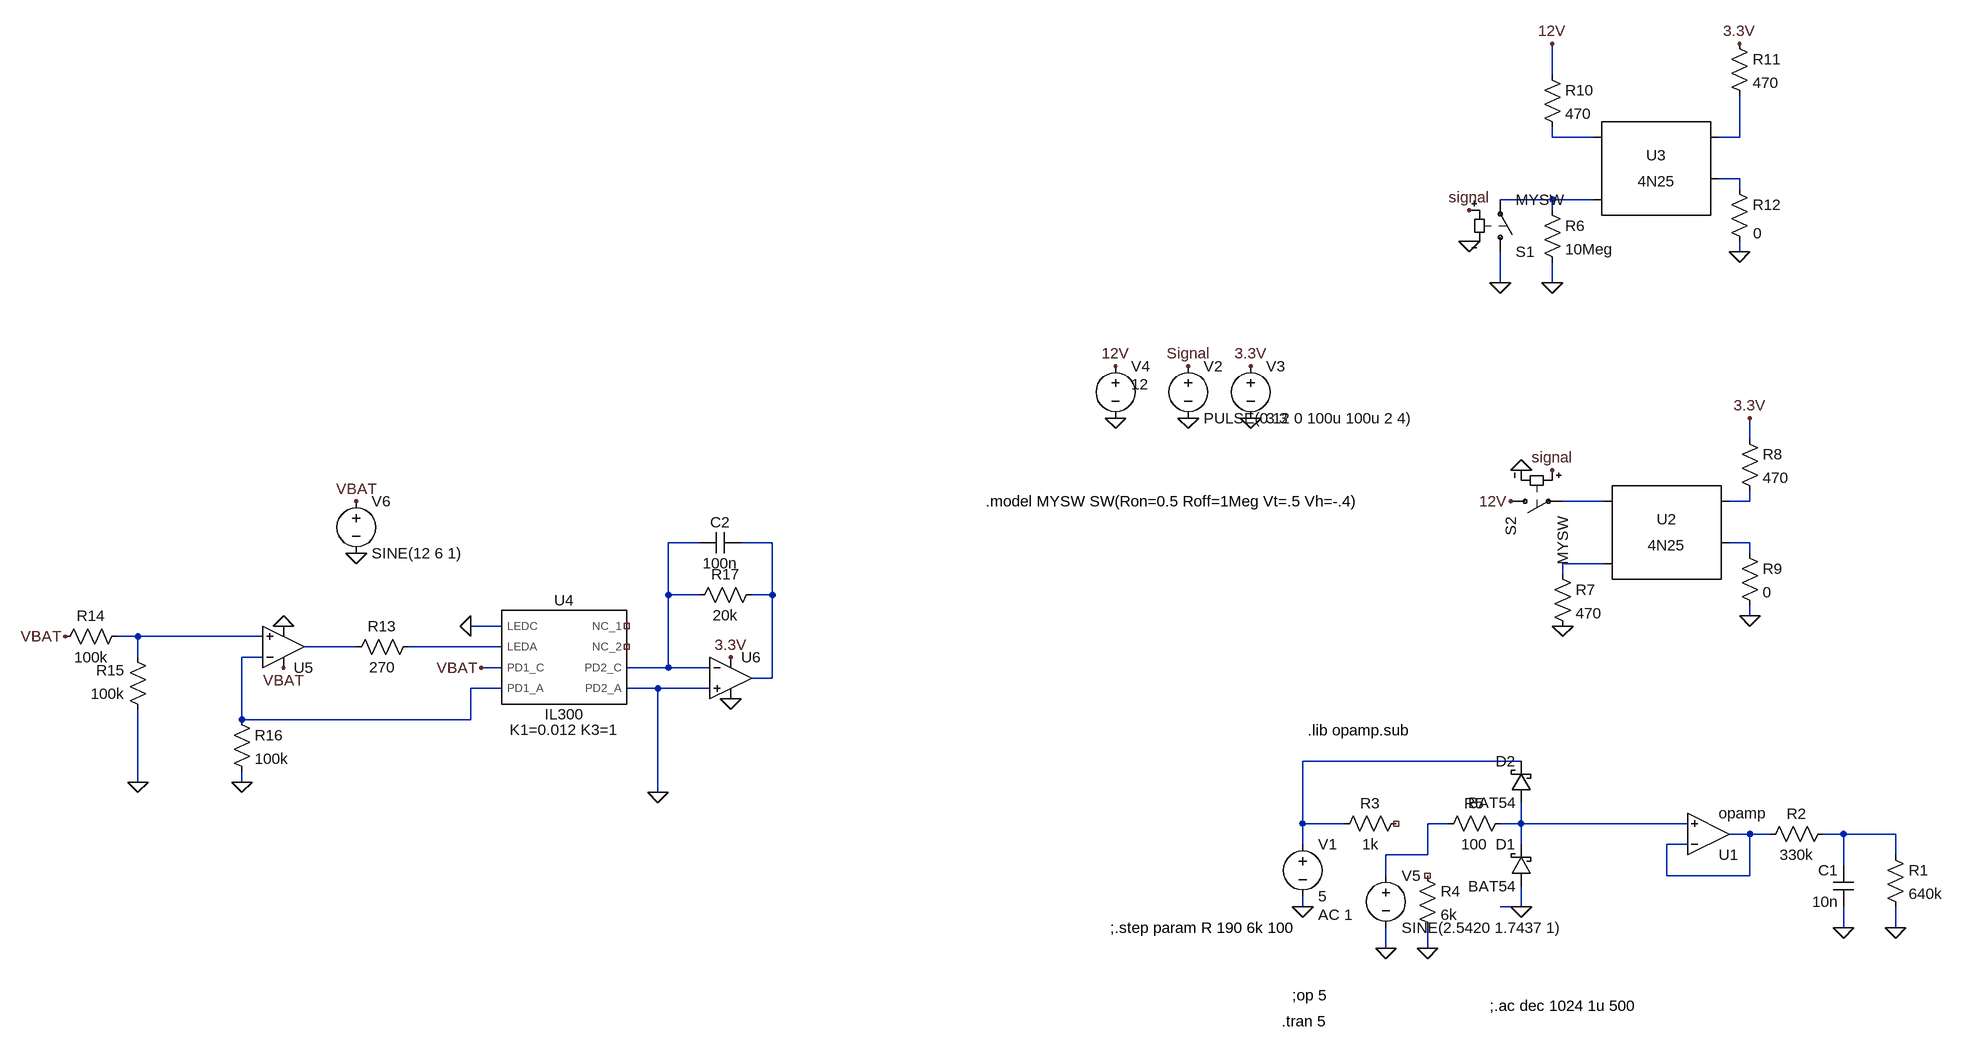
[diagram p0: schematic inputs_sim.asc]
inputs_sim.asc, the LTspice schematic file:
Version 4
SHEET 1 952 680
WIRE 64 -1024 64 -1072
WIRE 64 -928 64 -944
WIRE 128 -928 64 -928
WIRE 352 -928 352 -992
WIRE 352 -928 320 -928
WIRE 352 -864 320 -864
WIRE 352 -848 352 -864
WIRE 64 -832 -16 -832
WIRE 128 -832 64 -832
WIRE 64 -816 64 -832
WIRE 352 -752 352 -768
WIRE -16 -704 -16 -752
WIRE 64 -704 64 -736
WIRE 368 -464 368 -496
WIRE 144 -368 80 -368
WIRE 368 -368 368 -384
WIRE 368 -368 336 -368
WIRE -1248 -304 -1296 -304
WIRE -1136 -304 -1184 -304
WIRE 368 -304 336 -304
WIRE 368 -288 368 -304
WIRE 144 -272 80 -272
WIRE 80 -256 80 -272
WIRE -1296 -224 -1296 -304
WIRE -1248 -224 -1296 -224
WIRE -1136 -224 -1136 -304
WIRE -1136 -224 -1168 -224
WIRE 368 -192 368 -208
WIRE -1552 -176 -1600 -176
WIRE -2112 -160 -2144 -160
WIRE -1920 -160 -2112 -160
WIRE -1776 -144 -1856 -144
WIRE -1552 -144 -1696 -144
WIRE -2112 -128 -2112 -160
WIRE -1920 -128 -1952 -128
WIRE -1552 -112 -1584 -112
WIRE -1296 -112 -1296 -224
WIRE -1296 -112 -1360 -112
WIRE -1232 -112 -1296 -112
WIRE -1136 -96 -1136 -224
WIRE -1136 -96 -1168 -96
WIRE -1552 -80 -1600 -80
WIRE -1312 -80 -1360 -80
WIRE -1232 -80 -1312 -80
WIRE -1952 -32 -1952 -128
WIRE -1600 -32 -1600 -80
WIRE -1600 -32 -1952 -32
WIRE 16 32 -320 32
WIRE -2112 64 -2112 -48
WIRE -1952 64 -1952 48
WIRE -1312 80 -1312 -80
WIRE -320 128 -320 32
WIRE -256 128 -320 128
WIRE -96 128 -128 128
WIRE 16 128 16 96
WIRE 16 128 -16 128
WIRE 272 128 16 128
WIRE 368 144 336 144
WIRE 400 144 368 144
WIRE 512 144 480 144
WIRE 592 144 512 144
WIRE -320 160 -320 128
WIRE 16 160 16 128
WIRE 272 160 240 160
WIRE -128 176 -128 128
WIRE -128 176 -192 176
WIRE 592 176 592 144
WIRE 512 192 512 144
WIRE -192 208 -192 176
WIRE 240 208 240 160
WIRE 368 208 368 144
WIRE 368 208 240 208
WIRE -320 256 -320 240
WIRE 16 256 16 224
WIRE 16 256 -16 256
WIRE 512 288 512 256
WIRE 592 288 592 256
WIRE -192 320 -192 288
WIRE -128 320 -128 288
FLAG 512 288 0
FLAG -320 256 0
FLAG -128 320 0
FLAG 16 256 0
FLAG 592 288 0
FLAG -496 -496 0
FLAG -496 -576 Signal
FLAG -400 -496 0
FLAG -400 -576 3.3V
FLAG 64 -704 0
FLAG 80 -176 0
FLAG 368 -192 0
FLAG 368 -496 3.3V
FLAG -608 -496 0
FLAG -608 -576 12V
FLAG 64 -1072 12V
FLAG -16 -704 0
FLAG -64 -768 0
FLAG -64 -816 signal
FLAG 352 -752 0
FLAG 352 -1072 3.3V
FLAG 16 -416 0
FLAG 64 -416 signal
FLAG 0 -368 12V
FLAG -192 320 0
FLAG -1776 -288 0
FLAG -1776 -368 VBAT
FLAG -1584 -112 VBAT
FLAG -1600 -176 0
FLAG -1888 -176 0
FLAG -1888 -112 VBAT
FLAG -1952 64 0
FLAG -2112 64 0
FLAG -1312 80 0
FLAG -1200 -128 3.3V
FLAG -1200 -64 0
FLAG -2224 -160 VBAT
DATAFLAG 480 144 ""
SYMBOL Opamps\\opamp 304 208 M180
SYMATTR InstName U1
SYMBOL res 496 128 R90
WINDOW 0 0 56 VBottom 2
WINDOW 3 32 56 VTop 2
SYMATTR InstName R2
SYMATTR Value 330k
SYMBOL cap 528 256 R180
WINDOW 0 24 56 Left 2
WINDOW 3 24 8 Left 2
SYMATTR InstName C1
SYMATTR Value 10n
SYMBOL voltage -320 144 R0
WINDOW 123 24 124 Left 2
WINDOW 39 0 0 Left 0
SYMATTR Value2 AC 1
SYMATTR InstName V1
SYMATTR Value 5
SYMBOL res -160 112 R90
WINDOW 0 0 56 VBottom 2
WINDOW 3 32 56 VTop 2
SYMATTR InstName R3
SYMATTR Value 1k
SYMBOL res -144 192 R0
SYMATTR InstName R4
SYMATTR Value 6k
SYMBOL schottky 32 224 R180
WINDOW 0 24 64 Left 2
WINDOW 3 24 0 Left 2
SYMATTR InstName D1
SYMATTR Value BAT54
SYMATTR Description Zener Diode
SYMATTR Type zener
SYMBOL schottky 32 96 R180
WINDOW 0 24 64 Left 2
WINDOW 3 24 0 Left 2
SYMATTR InstName D2
SYMATTR Value BAT54
SYMATTR Description Zener Diode
SYMATTR Type zener
SYMBOL res 0 112 R90
WINDOW 0 0 56 VBottom 2
WINDOW 3 32 56 VTop 2
SYMATTR InstName R5
SYMATTR Value 100
SYMBOL res 576 160 R0
SYMATTR InstName R1
SYMATTR Value 640k
SYMBOL Optos\\4N25 240 -304 R0
SYMATTR InstName U2
SYMBOL voltage -496 -592 R0
WINDOW 123 0 0 Left 0
WINDOW 39 0 0 Left 0
SYMATTR InstName V2
SYMATTR Value PULSE(0 12 0 100u 100u 2 4)
SYMBOL voltage -400 -592 R0
WINDOW 123 0 0 Left 0
WINDOW 39 0 0 Left 0
SYMATTR InstName V3
SYMATTR Value 3.3
SYMBOL Optos\\4N25 224 -864 R0
SYMATTR InstName U3
SYMBOL res 48 -832 R0
SYMATTR InstName R6
SYMATTR Value 10Meg
SYMBOL res 64 -272 R0
SYMATTR InstName R7
SYMATTR Value 470
SYMBOL res 352 -480 R0
SYMATTR InstName R8
SYMATTR Value 470
SYMBOL voltage -608 -592 R0
WINDOW 3 24 44 Left 2
WINDOW 123 0 0 Left 0
WINDOW 39 0 0 Left 0
SYMATTR Value 12
SYMATTR InstName V4
SYMBOL res 352 -304 R0
SYMATTR InstName R9
SYMATTR Value 0
SYMBOL res 48 -1040 R0
SYMATTR InstName R10
SYMATTR Value 470
SYMBOL sw -16 -736 M180
SYMATTR InstName S1
SYMATTR Value MYSW
SYMBOL res 336 -1088 R0
SYMATTR InstName R11
SYMATTR Value 470
SYMBOL res 336 -864 R0
WINDOW 3 37 84 Left 2
SYMATTR Value 0
SYMATTR InstName R12
SYMBOL sw -16 -368 M90
SYMATTR InstName S2
SYMATTR Value MYSW
SYMBOL voltage -192 192 R0
WINDOW 123 0 0 Left 0
WINDOW 39 0 0 Left 0
SYMATTR InstName V5
SYMATTR Value SINE(2.5420 1.7437 1)
SYMBOL AutoGenerated\\IL300 -1456 -128 R0
SYMATTR InstName U4
SYMBOL voltage -1776 -384 R0
WINDOW 123 0 0 Left 0
WINDOW 39 0 0 Left 0
SYMATTR InstName V6
SYMATTR Value SINE(12 6 1)
SYMBOL OpAmps\\UniversalOpamp -1888 -144 M180
SYMATTR InstName U5
SYMBOL res -1680 -160 R90
WINDOW 0 0 56 VBottom 2
WINDOW 3 32 56 VTop 2
SYMATTR InstName R13
SYMATTR Value 270
SYMBOL res -2128 -176 R90
WINDOW 0 0 56 VBottom 2
WINDOW 3 32 56 VTop 2
SYMATTR InstName R14
SYMATTR Value 100k
SYMBOL res -2096 -32 R180
WINDOW 0 36 76 Left 2
WINDOW 3 36 40 Left 2
SYMATTR InstName R15
SYMATTR Value 100k
SYMBOL res -1968 -48 R0
SYMATTR InstName R16
SYMATTR Value 100k
SYMBOL OpAmps\\UniversalOpamp -1200 -96 R0
SYMATTR InstName U6
SYMBOL res -1152 -240 R90
WINDOW 0 0 56 VBottom 2
WINDOW 3 32 56 VTop 2
SYMATTR InstName R17
SYMATTR Value 20k
SYMBOL cap -1184 -320 R90
WINDOW 0 0 32 VBottom 2
WINDOW 3 32 32 VTop 2
SYMATTR InstName C2
SYMATTR Value 100n
TEXT -32 408 Left 2 !;.ac dec 1024 1u 500
TEXT -312 -16 Left 2 !.lib opamp.sub
TEXT -352 432 Left 2 !.tran 5
TEXT -616 288 Left 2 !;.step param R 190 6k 100
TEXT -336 392 Left 2 !;op 5
TEXT -808 -368 Left 2 !.model MYSW SW(Ron=0.5 Roff=1Meg Vt=.5 Vh=-.4)

The netlist it stands for:
* inputs_sim.asc
XU1 N018 N017 N018 opamp Aol=100K GBW=10Meg  ; pins invin noninvin out
R2 N019 N018 330k
C1 0 N019 10n
V1 N015 0 5 AC 1
R3 NC_01 N015 1k
R4 NC_02 0 6k
D1 0 N017 BAT54
D2 N017 N015 BAT54
R5 N017 N016 100
R1 N019 0 640k
XU2 N005 N010 N006 N009 NC_03 4N25
V2 Signal 0 PULSE(0 12 0 100u 100u 2 4)
V3 3.3V 0 3.3
XU3 N001 N004 N002 N003 NC_04 4N25
R6 N004 0 10Meg
R7 N010 0 470
R8 3.3V N006 470
V4 12V 0 12
R9 N009 0 0
R10 12V N001 470
S1 0 N004 Signal 0 MYSW
R11 3.3V N002 470
R12 N003 0 0
S2 12V N005 Signal 0 MYSW
V5 N016 0 SINE(2.5420 1.7437 1)
XU4 0 N013 VBAT N014 NC_05 NC_06 N007 0 IL300 K1=0.012 K3=1  ; pins LEDC LEDA PD1_C PD1_A NC_1 NC_2 PD2_C PD2_A
V6 VBAT 0 SINE(12 6 1)
XU5 N011 N014 VBAT 0 N012 level1 Avol=1Meg GBW=10Meg Vos=0 En=0 Enk=0 In=0 Ink=0 Rin=500Meg  ; pins In+ In- V+ V- OUT
R13 N013 N012 270
R14 N011 VBAT 100k
R15 0 N011 100k
R16 N014 0 100k
XU6 0 N007 3.3V 0 N008 level1 Avol=1Meg GBW=10Meg Vos=0 En=0 Enk=0 In=0 Ink=0 Rin=500Meg  ; pins In+ In- V+ V- OUT
R17 N008 N007 20k
C2 N008 N007 100n
.model D D
.lib standard.dio
;.ac dec 1024 1u 500
.lib opamp.sub
.tran 5
;.step param R 190 6k 100
;op 5
.model MYSW SW(Ron=0.5 Roff=1Meg Vt=.5 Vh=-.4)
.lib 4N25.sub
.lib Z:\home\whitfijs\Downloads\spiceil300\Spice Model_IL300\IL300.lib
.lib UniversalOpAmp1.lib
.backanno
.end